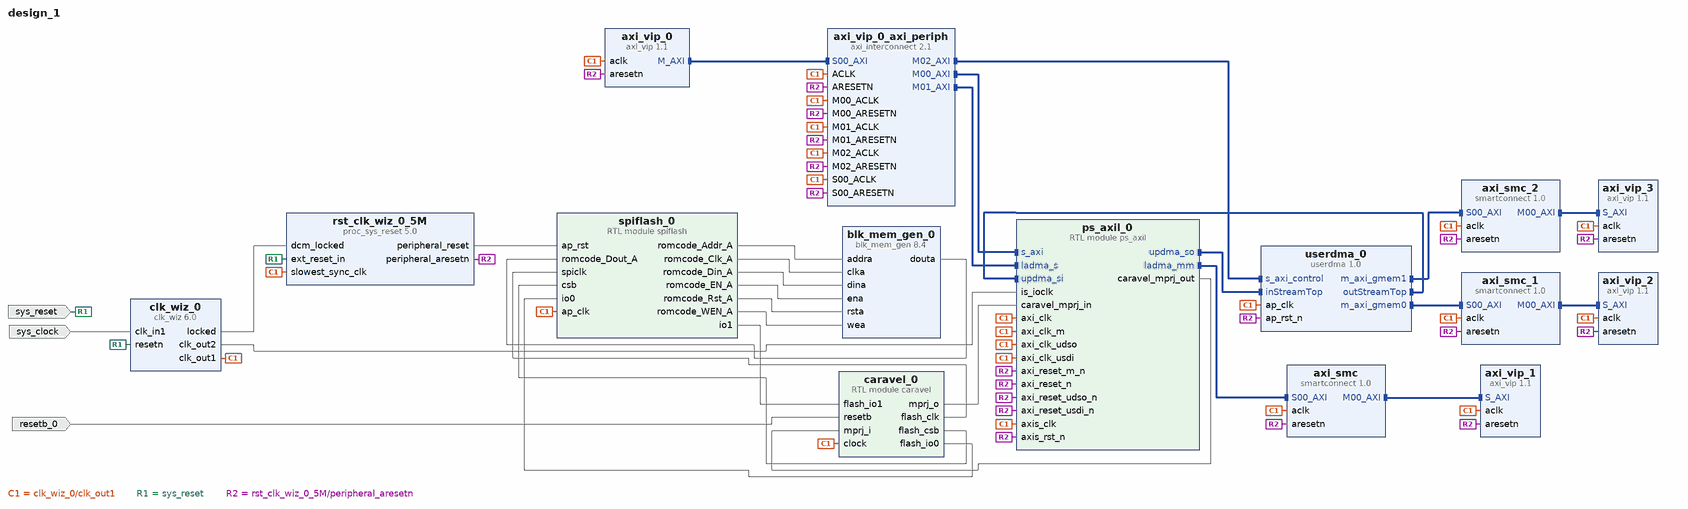
[diagram p0: block diagram of the top level]
# Vivado block design design_1, xc7z020clg400-1, Vivado 2022.1
create_bd_design design_1

create_bd_port -dir I resetb_0
create_bd_port -dir I -type clk sys_clock
set_property -dict {CONFIG.FREQ_HZ 250000000 CONFIG.PHASE 0.0} [get_bd_ports sys_clock]
create_bd_port -dir I -type rst sys_reset
set_property -dict {CONFIG.POLARITY ACTIVE_LOW} [get_bd_ports sys_reset]

create_bd_cell -type ip -vlnv xilinx.com:ip:smartconnect:1.0 axi_smc
set_property -dict {CONFIG.NUM_SI 1} [get_bd_cells axi_smc]
create_bd_cell -type ip -vlnv xilinx.com:ip:smartconnect:1.0 axi_smc_1
set_property -dict {CONFIG.NUM_SI 1} [get_bd_cells axi_smc_1]
create_bd_cell -type ip -vlnv xilinx.com:ip:smartconnect:1.0 axi_smc_2
set_property -dict {CONFIG.NUM_SI 1} [get_bd_cells axi_smc_2]
create_bd_cell -type ip -vlnv xilinx.com:ip:axi_vip:1.1 axi_vip_0
set_property -dict [list \
  CONFIG.ADDR_WIDTH 32 \
  CONFIG.DATA_WIDTH 32 \
  CONFIG.HAS_BRESP 1 \
  CONFIG.HAS_PROT 0 \
  CONFIG.HAS_RRESP 1 \
  CONFIG.HAS_WSTRB 1 \
  CONFIG.INTERFACE_MODE MASTER \
  CONFIG.PROTOCOL AXI4LITE \
  CONFIG.READ_WRITE_MODE READ_WRITE \
] [get_bd_cells axi_vip_0]
create_bd_cell -type ip -vlnv xilinx.com:ip:axi_interconnect:2.1 axi_vip_0_axi_periph
set_property -dict {CONFIG.NUM_MI 3} [get_bd_cells axi_vip_0_axi_periph]
create_bd_cell -type ip -vlnv xilinx.com:ip:axi_vip:1.1 axi_vip_1
set_property -dict {CONFIG.INTERFACE_MODE SLAVE} [get_bd_cells axi_vip_1]
create_bd_cell -type ip -vlnv xilinx.com:ip:axi_vip:1.1 axi_vip_2
set_property -dict {CONFIG.INTERFACE_MODE SLAVE} [get_bd_cells axi_vip_2]
create_bd_cell -type ip -vlnv xilinx.com:ip:axi_vip:1.1 axi_vip_3
set_property -dict {CONFIG.INTERFACE_MODE SLAVE} [get_bd_cells axi_vip_3]
create_bd_cell -type ip -vlnv xilinx.com:ip:blk_mem_gen:8.4 blk_mem_gen_0
set_property -dict [list \
  CONFIG.Coe_File ../../../../../../../fsic.coe \
  CONFIG.EN_SAFETY_CKT true \
  CONFIG.Enable_32bit_Address true \
  CONFIG.Enable_A Use_ENA_Pin \
  CONFIG.Fill_Remaining_Memory_Locations true \
  CONFIG.Load_Init_File true \
  CONFIG.Memory_Type Single_Port_RAM \
  CONFIG.Operating_Mode_A READ_FIRST \
  CONFIG.Port_A_Write_Rate 50 \
  CONFIG.Port_B_Clock 0 \
  CONFIG.Port_B_Enable_Rate 0 \
  CONFIG.Port_B_Write_Rate 0 \
  CONFIG.Register_PortA_Output_of_Memory_Core false \
  CONFIG.Register_PortA_Output_of_Memory_Primitives false \
  CONFIG.Use_RSTA_Pin true \
  CONFIG.use_bram_block Stand_Alone \
] [get_bd_cells blk_mem_gen_0]
create_bd_cell -type module -reference caravel caravel_0
create_bd_cell -type ip -vlnv xilinx.com:ip:clk_wiz:6.0 clk_wiz_0
set_property -dict [list \
  CONFIG.CLKIN1_JITTER_PS 40.0 \
  CONFIG.CLKOUT1_JITTER 925.151 \
  CONFIG.CLKOUT1_PHASE_ERROR 919.522 \
  CONFIG.CLKOUT1_REQUESTED_OUT_FREQ 5 \
  CONFIG.CLKOUT2_JITTER 761.006 \
  CONFIG.CLKOUT2_PHASE_ERROR 919.522 \
  CONFIG.CLKOUT2_REQUESTED_OUT_FREQ 20 \
  CONFIG.CLKOUT2_USED true \
  CONFIG.CLK_IN1_BOARD_INTERFACE Custom \
  CONFIG.MMCM_CLKFBOUT_MULT_F 64.000 \
  CONFIG.MMCM_CLKIN1_PERIOD 4.000 \
  CONFIG.MMCM_CLKIN2_PERIOD 10.0 \
  CONFIG.MMCM_CLKOUT0_DIVIDE_F 128.000 \
  CONFIG.MMCM_CLKOUT1_DIVIDE 32 \
  CONFIG.MMCM_DIVCLK_DIVIDE 25 \
  CONFIG.NUM_OUT_CLKS 2 \
  CONFIG.RESET_PORT resetn \
  CONFIG.RESET_TYPE ACTIVE_LOW \
  CONFIG.USE_BOARD_FLOW true \
] [get_bd_cells clk_wiz_0]
create_bd_cell -type module -reference ps_axil ps_axil_0
create_bd_cell -type ip -vlnv xilinx.com:ip:proc_sys_reset:5.0 rst_clk_wiz_0_5M
create_bd_cell -type module -reference spiflash spiflash_0
create_bd_cell -type ip -vlnv xilinx.com:hls:userdma:1.0 userdma_0

# ---- connections ----

connect_bd_intf_net [get_bd_intf_pins axi_smc_1/M00_AXI] [get_bd_intf_pins axi_vip_2/S_AXI]
connect_bd_intf_net [get_bd_intf_pins axi_smc_2/M00_AXI] [get_bd_intf_pins axi_vip_3/S_AXI]
connect_bd_intf_net [get_bd_intf_pins axi_smc/M00_AXI] [get_bd_intf_pins axi_vip_1/S_AXI]
connect_bd_intf_net [get_bd_intf_pins axi_vip_0/M_AXI] [get_bd_intf_pins axi_vip_0_axi_periph/S00_AXI]
connect_bd_intf_net [get_bd_intf_pins axi_vip_0_axi_periph/M00_AXI] [get_bd_intf_pins ps_axil_0/s_axi]
connect_bd_intf_net [get_bd_intf_pins axi_vip_0_axi_periph/M01_AXI] [get_bd_intf_pins ps_axil_0/ladma_s]
connect_bd_intf_net [get_bd_intf_pins axi_vip_0_axi_periph/M02_AXI] [get_bd_intf_pins userdma_0/s_axi_control]
connect_bd_intf_net [get_bd_intf_pins axi_smc/S00_AXI] [get_bd_intf_pins ps_axil_0/ladma_mm]
connect_bd_intf_net [get_bd_intf_pins ps_axil_0/updma_so] [get_bd_intf_pins userdma_0/inStreamTop]
connect_bd_intf_net [get_bd_intf_pins axi_smc_1/S00_AXI] [get_bd_intf_pins userdma_0/m_axi_gmem0]
connect_bd_intf_net [get_bd_intf_pins axi_smc_2/S00_AXI] [get_bd_intf_pins userdma_0/m_axi_gmem1]
connect_bd_intf_net [get_bd_intf_pins ps_axil_0/updma_si] [get_bd_intf_pins userdma_0/outStreamTop]
connect_bd_net [get_bd_pins blk_mem_gen_0/douta] [get_bd_pins spiflash_0/romcode_Dout_A]
connect_bd_net [get_bd_pins caravel_0/flash_clk] [get_bd_pins spiflash_0/spiclk]
connect_bd_net [get_bd_pins caravel_0/flash_csb] [get_bd_pins spiflash_0/csb]
connect_bd_net [get_bd_pins caravel_0/flash_io0] [get_bd_pins spiflash_0/io0]
connect_bd_net [get_bd_pins caravel_0/mprj_o] [get_bd_pins ps_axil_0/caravel_mprj_in]
connect_bd_net [get_bd_pins clk_wiz_0/clk_out1] \
  [get_bd_pins axi_smc/aclk] [get_bd_pins axi_smc_1/aclk] [get_bd_pins axi_smc_2/aclk] [get_bd_pins axi_vip_0/aclk] \
  [get_bd_pins axi_vip_0_axi_periph/ACLK] [get_bd_pins axi_vip_0_axi_periph/M00_ACLK] \
  [get_bd_pins axi_vip_0_axi_periph/M01_ACLK] [get_bd_pins axi_vip_0_axi_periph/M02_ACLK] \
  [get_bd_pins axi_vip_0_axi_periph/S00_ACLK] [get_bd_pins axi_vip_1/aclk] [get_bd_pins axi_vip_2/aclk] \
  [get_bd_pins axi_vip_3/aclk] [get_bd_pins caravel_0/clock] [get_bd_pins ps_axil_0/axi_clk] \
  [get_bd_pins ps_axil_0/axi_clk_m] [get_bd_pins ps_axil_0/axi_clk_udso] [get_bd_pins ps_axil_0/axi_clk_usdi] \
  [get_bd_pins ps_axil_0/axis_clk] [get_bd_pins rst_clk_wiz_0_5M/slowest_sync_clk] [get_bd_pins spiflash_0/ap_clk] \
  [get_bd_pins userdma_0/ap_clk]
connect_bd_net [get_bd_pins clk_wiz_0/clk_out2] [get_bd_pins ps_axil_0/is_ioclk]
connect_bd_net [get_bd_pins clk_wiz_0/locked] [get_bd_pins rst_clk_wiz_0_5M/dcm_locked]
connect_bd_net [get_bd_pins ps_axil_0/caravel_mprj_out] [get_bd_pins caravel_0/mprj_i]
connect_bd_net -net reset_rtl_1 [get_bd_ports sys_reset] [get_bd_pins clk_wiz_0/resetn] [get_bd_pins rst_clk_wiz_0_5M/ext_reset_in]
connect_bd_net -net resetb_0_1 [get_bd_ports resetb_0] [get_bd_pins caravel_0/resetb]
connect_bd_net [get_bd_pins rst_clk_wiz_0_5M/peripheral_aresetn] \
  [get_bd_pins axi_smc/aresetn] [get_bd_pins axi_smc_1/aresetn] [get_bd_pins axi_smc_2/aresetn] \
  [get_bd_pins axi_vip_0/aresetn] [get_bd_pins axi_vip_0_axi_periph/ARESETN] [get_bd_pins axi_vip_0_axi_periph/M00_ARESETN] \
  [get_bd_pins axi_vip_0_axi_periph/M01_ARESETN] [get_bd_pins axi_vip_0_axi_periph/M02_ARESETN] \
  [get_bd_pins axi_vip_0_axi_periph/S00_ARESETN] [get_bd_pins axi_vip_1/aresetn] [get_bd_pins axi_vip_2/aresetn] \
  [get_bd_pins axi_vip_3/aresetn] [get_bd_pins ps_axil_0/axi_reset_m_n] [get_bd_pins ps_axil_0/axi_reset_n] \
  [get_bd_pins ps_axil_0/axi_reset_udso_n] [get_bd_pins ps_axil_0/axi_reset_usdi_n] [get_bd_pins ps_axil_0/axis_rst_n] \
  [get_bd_pins userdma_0/ap_rst_n]
connect_bd_net [get_bd_pins rst_clk_wiz_0_5M/peripheral_reset] [get_bd_pins spiflash_0/ap_rst]
connect_bd_net [get_bd_pins spiflash_0/io1] [get_bd_pins caravel_0/flash_io1]
connect_bd_net [get_bd_pins spiflash_0/romcode_Addr_A] [get_bd_pins blk_mem_gen_0/addra]
connect_bd_net [get_bd_pins spiflash_0/romcode_Clk_A] [get_bd_pins blk_mem_gen_0/clka]
connect_bd_net [get_bd_pins spiflash_0/romcode_Din_A] [get_bd_pins blk_mem_gen_0/dina]
connect_bd_net [get_bd_pins spiflash_0/romcode_EN_A] [get_bd_pins blk_mem_gen_0/ena]
connect_bd_net [get_bd_pins spiflash_0/romcode_Rst_A] [get_bd_pins blk_mem_gen_0/rsta]
connect_bd_net [get_bd_pins spiflash_0/romcode_WEN_A] [get_bd_pins blk_mem_gen_0/wea]
connect_bd_net [get_bd_ports sys_clock] [get_bd_pins clk_wiz_0/clk_in1]

# ---- address map ----
assign_bd_address -offset 0x60000000 -range 32K -target_address_space [get_bd_addr_spaces axi_vip_0/Master_AXI] [get_bd_addr_segs ps_axil_0/s_axi/reg0]
assign_bd_address -offset 0x60008000 -range 4K -target_address_space [get_bd_addr_spaces axi_vip_0/Master_AXI] [get_bd_addr_segs ps_axil_0/ladma_s/reg0]
assign_bd_address -offset 0x60009000 -range 4K -target_address_space [get_bd_addr_spaces axi_vip_0/Master_AXI] [get_bd_addr_segs userdma_0/s_axi_control/Reg]
assign_bd_address -offset 0x0000000044A00000 -range 32K -target_address_space [get_bd_addr_spaces ps_axil_0/ladma_mm] [get_bd_addr_segs axi_vip_1/S_AXI/Reg]
assign_bd_address -offset 0x0000000045000000 -range 512K -target_address_space [get_bd_addr_spaces userdma_0/Data_m_axi_gmem0] [get_bd_addr_segs axi_vip_2/S_AXI/Reg]
assign_bd_address -offset 0x0000000045080000 -range 512K -target_address_space [get_bd_addr_spaces userdma_0/Data_m_axi_gmem1] [get_bd_addr_segs axi_vip_3/S_AXI/Reg]

validate_bd_design
save_bd_design
